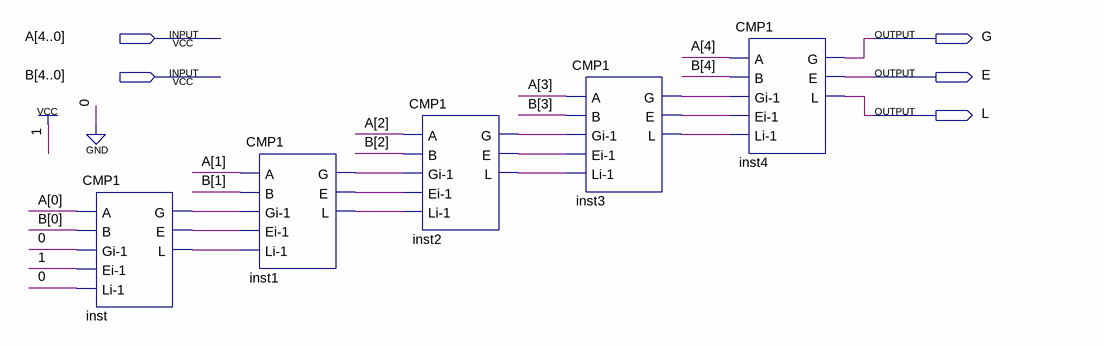
[diagram p0: schematic sheet]
// Quartus schematic CMP5.bdf as structural Verilog: 5 symbols, 5 pins
module CMP5 (
  input  [4:0] A,
  input  [4:0] B,
  output G,
  output E,
  output L
);

  wire inst1_e, inst1_g, inst1_l, inst2_e, inst2_g, inst2_l, inst3_e, inst3_g, inst3_l, inst_e, inst_g,
       inst_l;

  CMP1 inst (.A(A[0]), .B(B[0]), .\Gi-1 (1'b0), .\Ei-1 (1'b1), .\Li-1 (1'b0), .G(inst_g), .E(inst_e), .L(inst_l));
  CMP1 inst1 (
    .A(A[1]), .B(B[1]), .\Gi-1 (inst_g), .\Ei-1 (inst_e), .\Li-1 (inst_l), .G(inst1_g), .E(inst1_e),
    .L(inst1_l));
  CMP1 inst2 (
    .A(A[2]), .B(B[2]), .\Gi-1 (inst1_g), .\Ei-1 (inst1_e), .\Li-1 (inst1_l), .G(inst2_g), .E(inst2_e),
    .L(inst2_l));
  CMP1 inst3 (
    .A(A[3]), .B(B[3]), .\Gi-1 (inst2_g), .\Ei-1 (inst2_e), .\Li-1 (inst2_l), .G(inst3_g), .E(inst3_e),
    .L(inst3_l));
  CMP1 inst4 (.A(A[4]), .B(B[4]), .\Gi-1 (inst3_g), .\Ei-1 (inst3_e), .\Li-1 (inst3_l), .G(G), .E(E), .L(L));
endmodule
